# EAGLE schematic ESP-12_Breakout_SMT (EAGLE 7.4.0)
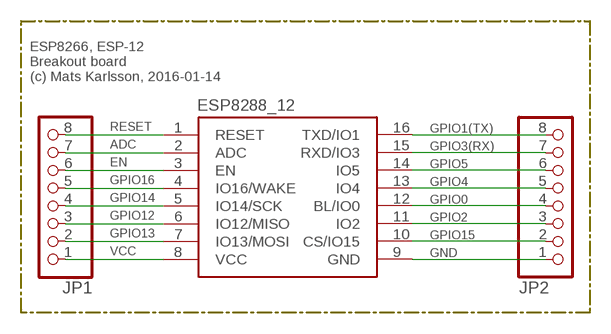
[diagram p0: schematic, sheet 1]

## Parts
ESP8288_12  ESP8266-12  [ESP8266-12]
JP1  PINHD-1X81X08_SMT  [1X08_SMT]
JP2  PINHD-1X81X08_SMT  [1X08_SMT]

## Nets
ADC: ESP8288_12.2(ADC) JP1.7
EN: ESP8288_12.3(EN) JP1.6
GND: ESP8288_12.9(GND) JP2.1
GPIO0: ESP8288_12.12(BL/IO0) JP2.4
GPIO1(TX): ESP8288_12.16(TXD/IO1) JP2.8
GPIO2: ESP8288_12.11(IO2) JP2.3
GPIO3(RX): ESP8288_12.15(RXD/IO3) JP2.7
GPIO4: ESP8288_12.13(IO4) JP2.5
GPIO5: ESP8288_12.14(IO5) JP2.6
GPIO12: ESP8288_12.6(IO12/MISO) JP1.3
GPIO13: ESP8288_12.7(IO13/MOSI) JP1.2
GPIO14: ESP8288_12.5(IO14/SCK) JP1.4
GPIO15: ESP8288_12.10(CS/IO15) JP2.2
GPIO16: ESP8288_12.4(IO16/WAKE) JP1.5
RESET: ESP8288_12.1(RESET) JP1.8
VCC: ESP8288_12.8(VCC) JP1.1

## Notes on the sheet
- ESP8266, ESP-12
  Breakout board
  (c) Mats Karlsson, 2016-01-14

## Library data of the parts
ESP8288_12 = we-chip:ESP8266-12: Espressif ESP8266 ESP-12 and ESP-WROOM WiFi/WLAN-Module
JP1 JP2 = pinhead+:PINHD-1X8: PIN HEADER